# Altium project MegaD-328 16I_(Top_board).PrjPcb
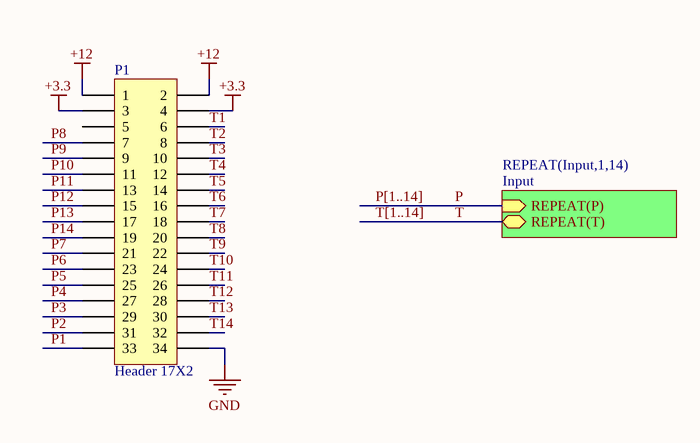
[diagram p0: Top_board.SchDoc]
2 sheets, 127 parts. Net scope: hierarchical (ports join the sheet entries above them; power ports are global).
Board file: Top_board.PcbDoc
Sheets:
  Top_board.SchDoc
    Input1 = Input.SchDoc
    Input2 = Input.SchDoc
    Input3 = Input.SchDoc
    Input4 = Input.SchDoc
    Input5 = Input.SchDoc
    Input6 = Input.SchDoc
    Input7 = Input.SchDoc
    Input8 = Input.SchDoc
    Input9 = Input.SchDoc
    Input10 = Input.SchDoc
    Input11 = Input.SchDoc
    Input12 = Input.SchDoc
    Input13 = Input.SchDoc
    Input14 = Input.SchDoc

## Sheet Top_board.SchDoc
size A4

### Parts
(Parts that share a designator on the sheet are numbered #1, #2 ... from top to bottom, then left to right.)
P1#1  Header 17X2  [HDR2X17-PLC]

### Sub-sheets
REPEAT(Input,1,14) = Input: REPEAT(P) (in), REPEAT(T) (bidir)

### Nets
+3.3: P1#1.3 P1#1.4
+12: P1#1.1 P1#1.2
GND: P1#1.34
P1: P1#1.33
P2: P1#1.31
P3: P1#1.29
P4: P1#1.27
P5: P1#1.25
P6: P1#1.23
P7: P1#1.21
P8: P1#1.7
P9: P1#1.9
P10: P1#1.11
P11: P1#1.13
P12: P1#1.15
P13: P1#1.17
P14: P1#1.19
T1: P1#1.6
T2: P1#1.8
T3: P1#1.10
T4: P1#1.12
T5: P1#1.14
T6: P1#1.16
T7: P1#1.18
T8: P1#1.20
T9: P1#1.22
T10: P1#1.24
T11: P1#1.26
T12: P1#1.28
T13: P1#1.30
T14: P1#1.32

Not connected (* = marked no-connect by the designer): P1#1 5

### Buses and harness runs
bus P[1..14]
bus T[1..14]

### Library data of the parts
P1#1 = Header 17X2: Header, 17-Pin, Dual row; LatestRevisionDate: 17-Jul-2002; LatestRevisionNote: Re-released for DXP Platform.; Publisher: Altium Limited

## Sheet Input.SchDoc
size A4
Used 14 times, as channels Input1, Input2, Input3, Input4, Input5, Input6, Input7, Input8, Input9, Input10, Input11, Input12, Input13, Input14. Parts and nets are listed once, with the designators drawn on the sheet.
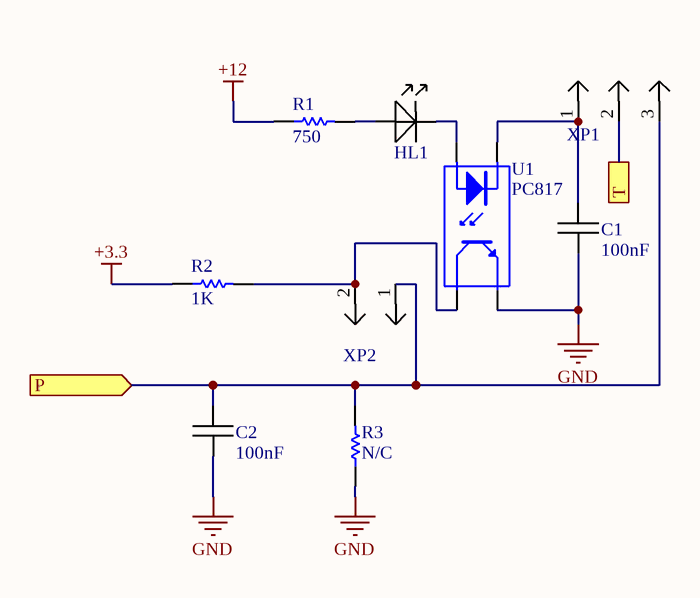
[diagram p1: Input.SchDoc]

### Parts
C1  Val: 100nF  [CAP0805]  (hidden comment: CAP_SMD)
C2  Val: 100nF  [CAP0805]  (hidden comment: CAP_SMD)
HL1  LED_SMD  [0805_LED]  (value not drawn)
R1  Val: 750  [RES0805]  (hidden comment: RES_SMD)
R2  Val: 1K  [RES0805]  (hidden comment: RES_SMD)
R3  Val: N/C  [RES0805]  (hidden comment: RES_SMD)
U1  PC817  [DIP-4 - SMT]
XP1  PLS-03  [PLS-03]  (value not drawn)
XP2  PLS-02  [PLS-02]  (value not drawn)

### Ports
P (in), T

### Nets
+3.3: R2.1
+12: R1.1
GND: C1.1 C2.1 R3.1 U1.3(E)
P: C2.2 R3.2 XP1.3 XP2.1 ; port P
T: XP1.2 ; port T
NetC1_2: C1.2 U1.2(K) XP1.1
NetHL1_1: HL1.1(anode) R1.2
NetHL1_2: HL1.2(cathode) U1.1(A)
NetR2_2: R2.2 U1.4(C) XP2.2

### Channels
Input1: designators C1=C1_Input1 C2=C2_Input1 HL1=HL1_Input1 R1=R1_Input1 R2=R2_Input1 R3=R3_Input1 U1=U1_I1 XP1=XP1_Input1 XP2=P0; ports P=P1 T=T1
Input2: designators C1=C1_Input2 C2=C2_Input2 HL1=HL1_Input2 R1=R1_Input2 R2=R2_Input2 R3=R3_Input2 U1=U1_I2 XP1=XP1_Input2 XP2=P1#2; ports P=P2 T=T2
Input3: designators C1=C1_Input3 C2=C2_Input3 HL1=HL1_Input3 R1=R1_Input3 R2=R2_Input3 R3=R3_Input3 U1=U1_I3 XP1=XP1_Input3 XP2=P2; ports P=P3 T=T3
Input4: designators C1=C1_Input4 C2=C2_Input4 HL1=HL1_Input4 R1=R1_Input4 R2=R2_Input4 R3=R3_Input4 U1=U1_I4#1 XP1=XP1_Input4 XP2=P3; ports P=P4 T=T4
Input5: designators C1=C1_Input5 C2=C2_Input5 HL1=HL1_Input5 R1=R1_Input5 R2=R2_Input5 R3=R3_Input5 U1=U1_I5 XP1=XP1_Input5 XP2=P4; ports P=P5 T=T5
Input6: designators C1=C1_Input6 C2=C2_Input6 HL1=HL1_Input6 R1=R1_Input6 R2=R2_Input6 R3=R3_Input6 U1=U1_I6 XP1=XP1_Input6 XP2=P5; ports P=P6 T=T6
Input7: designators C1=C1_Input7 C2=C2_Input7 HL1=HL1_Input7 R1=R1_Input7 R2=R2_Input7 R3=R3_Input7 U1=U1_I7 XP1=XP1_Input7 XP2=P6; ports P=P7 T=T7
Input8: designators C1=C1_Input8 C2=C2_Input8 HL1=HL1_Input8 R1=R1_Input8 R2=R2_Input8 R3=R3_Input8 U1=U1_I8 XP1=XP1_Input8 XP2=P7; ports P=P8 T=T8
Input9: designators C1=C1_Input9 C2=C2_Input9 HL1=HL1_Input9 R1=R1_Input9 R2=R2_Input9 R3=R3_Input9 U1=U1_I9 XP1=XP1_Input9 XP2=P8; ports P=P9 T=T9
Input10: designators C1=C1_Input10 C2=C2_Input10 HL1=HL1_Input10 R1=R1_Input10 R2=R2_Input10 R3=R3_Input10 U1=U1_I10 XP1=XP1_Input10 XP2=P9; ports P=P10 T=T10
Input11: designators C1=C1_Input11 C2=C2_Input11 HL1=HL1_Input11 R1=R1_Input11 R2=R2_Input11 R3=R3_Input11 U1=U1_I11 XP1=XP1_Input11 XP2=10; ports P=P11 T=T11
Input12: designators C1=C1_Input12 C2=C2_Input12 HL1=HL1_Input12 R1=R1_Input12 R2=R2_Input12 R3=R3_Input12 U1=U1_I12 XP1=XP1_Input12 XP2=11; ports P=P12 T=T12
Input13: designators C1=C1_Input13 C2=C2_Input13 HL1=HL1_Input13 R1=R1_Input13 R2=R2_Input13 R3=R3_Input13 U1=U1_I13 XP1=XP1_Input13 XP2=P12; ports P=P13 T=T13
Input14: designators C1=C1_Input14 C2=C2_Input14 HL1=HL1_Input14 R1=R1_Input14 R2=R2_Input14 R3=R3_Input14 U1=U1_I4#2 XP1=XP1_Input14 XP2=P13; ports P=P14 T=T14

### Library data of the parts
C1 C2 = CAP_SMD: Ceramic capacitor, 0805
HL1 = LED_SMD: 0805 led
U1 = PC817: 4-Pin Phototransistor Optocoupler; Published: 24-Mar-1999; LatestRevisionDate: 04-Mar-2005; LatestRevisionNote: Sch pins 3 & 4 Swapped.; DatasheetVersion: Nov-2003; PackageReference: DIP-4; Publisher: Altium Limited

## Nets that join several sheets
+3.3: Top_board (P1#1.3 P1#1.4), Input1 (R2_Input1.1), Input2 (R2_Input2.1), Input3 (R2_Input3.1), Input4 (R2_Input4.1), Input5 (R2_Input5.1), Input6 (R2_Input6.1), Input7 (R2_Input7.1), Input8 (R2_Input8.1), Input9 (R2_Input9.1), Input10 (R2_Input10.1), Input11 (R2_Input11.1), Input12 (R2_Input12.1), Input13 (R2_Input13.1), Input14 (R2_Input14.1)
+12: Top_board (P1#1.1 P1#1.2), Input1 (R1_Input1.1), Input2 (R1_Input2.1), Input3 (R1_Input3.1), Input4 (R1_Input4.1), Input5 (R1_Input5.1), Input6 (R1_Input6.1), Input7 (R1_Input7.1), Input8 (R1_Input8.1), Input9 (R1_Input9.1), Input10 (R1_Input10.1), Input11 (R1_Input11.1), Input12 (R1_Input12.1), Input13 (R1_Input13.1), Input14 (R1_Input14.1)
GND: Top_board (P1#1.34), Input1 (C1_Input1.1 C2_Input1.1 R3_Input1.1 U1_I1.3), Input2 (C1_Input2.1 C2_Input2.1 R3_Input2.1 U1_I2.3), Input3 (C1_Input3.1 C2_Input3.1 R3_Input3.1 U1_I3.3), Input4 (C1_Input4.1 C2_Input4.1 R3_Input4.1 U1_I4#1.3), Input5 (C1_Input5.1 C2_Input5.1 R3_Input5.1 U1_I5.3), Input6 (C1_Input6.1 C2_Input6.1 R3_Input6.1 U1_I6.3), Input7 (C1_Input7.1 C2_Input7.1 R3_Input7.1 U1_I7.3), Input8 (C1_Input8.1 C2_Input8.1 R3_Input8.1 U1_I8.3), Input9 (C1_Input9.1 C2_Input9.1 R3_Input9.1 U1_I9.3), Input10 (C1_Input10.1 C2_Input10.1 R3_Input10.1 U1_I10.3), Input11 (C1_Input11.1 C2_Input11.1 R3_Input11.1 U1_I11.3), Input12 (C1_Input12.1 C2_Input12.1 R3_Input12.1 U1_I12.3), Input13 (C1_Input13.1 C2_Input13.1 R3_Input13.1 U1_I13.3), Input14 (C1_Input14.1 C2_Input14.1 R3_Input14.1 U1_I4#2.3)
P1: Top_board (P1#1.33), Input1 (C2_Input1.2 P0.1 R3_Input1.2 XP1_Input1.3)
P2: Top_board (P1#1.31), Input2 (C2_Input2.2 P1#2.1 R3_Input2.2 XP1_Input2.3)
P3: Top_board (P1#1.29), Input3 (C2_Input3.2 P2.1 R3_Input3.2 XP1_Input3.3)
P4: Top_board (P1#1.27), Input4 (C2_Input4.2 P3.1 R3_Input4.2 XP1_Input4.3)
P5: Top_board (P1#1.25), Input5 (C2_Input5.2 P4.1 R3_Input5.2 XP1_Input5.3)
P6: Top_board (P1#1.23), Input6 (C2_Input6.2 P5.1 R3_Input6.2 XP1_Input6.3)
P7: Top_board (P1#1.21), Input7 (C2_Input7.2 P6.1 R3_Input7.2 XP1_Input7.3)
P8: Top_board (P1#1.7), Input8 (C2_Input8.2 P7.1 R3_Input8.2 XP1_Input8.3)
P9: Top_board (P1#1.9), Input9 (C2_Input9.2 P8.1 R3_Input9.2 XP1_Input9.3)
P10: Top_board (P1#1.11), Input10 (C2_Input10.2 P9.1 R3_Input10.2 XP1_Input10.3)
P11: Top_board (P1#1.13), Input11 (10.1 C2_Input11.2 R3_Input11.2 XP1_Input11.3)
P12: Top_board (P1#1.15), Input12 (11.1 C2_Input12.2 R3_Input12.2 XP1_Input12.3)
P13: Top_board (P1#1.17), Input13 (C2_Input13.2 P12.1 R3_Input13.2 XP1_Input13.3)
P14: Top_board (P1#1.19), Input14 (C2_Input14.2 P13.1 R3_Input14.2 XP1_Input14.3)
T1: Top_board (P1#1.6), Input1 (XP1_Input1.2)
T2: Top_board (P1#1.8), Input2 (XP1_Input2.2)
T3: Top_board (P1#1.10), Input3 (XP1_Input3.2)
T4: Top_board (P1#1.12), Input4 (XP1_Input4.2)
T5: Top_board (P1#1.14), Input5 (XP1_Input5.2)
T6: Top_board (P1#1.16), Input6 (XP1_Input6.2)
T7: Top_board (P1#1.18), Input7 (XP1_Input7.2)
T8: Top_board (P1#1.20), Input8 (XP1_Input8.2)
T9: Top_board (P1#1.22), Input9 (XP1_Input9.2)
T10: Top_board (P1#1.24), Input10 (XP1_Input10.2)
T11: Top_board (P1#1.26), Input11 (XP1_Input11.2)
T12: Top_board (P1#1.28), Input12 (XP1_Input12.2)
T13: Top_board (P1#1.30), Input13 (XP1_Input13.2)
T14: Top_board (P1#1.32), Input14 (XP1_Input14.2)